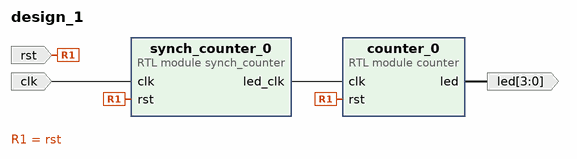
[diagram p0: block diagram of the top level]
# Vivado block design design_1, xc7z007sclg400-1, Vivado 2024.1.1
create_bd_design design_1

create_bd_port -dir I clk
create_bd_port -dir I rst
create_bd_port -dir O -from 3 -to 0 led

create_bd_cell -type module -reference counter counter_0
create_bd_cell -type module -reference synch_counter synch_counter_0

# ---- connections ----

connect_bd_net [get_bd_ports clk] [get_bd_pins synch_counter_0/clk]
connect_bd_net [get_bd_pins counter_0/led] [get_bd_ports led]
connect_bd_net [get_bd_ports rst] [get_bd_pins synch_counter_0/rst] [get_bd_pins counter_0/rst]
connect_bd_net [get_bd_pins synch_counter_0/led_clk] [get_bd_pins counter_0/clk]

validate_bd_design
save_bd_design
